# EAGLE design linvinus_ups (EAGLE 7.3.0)
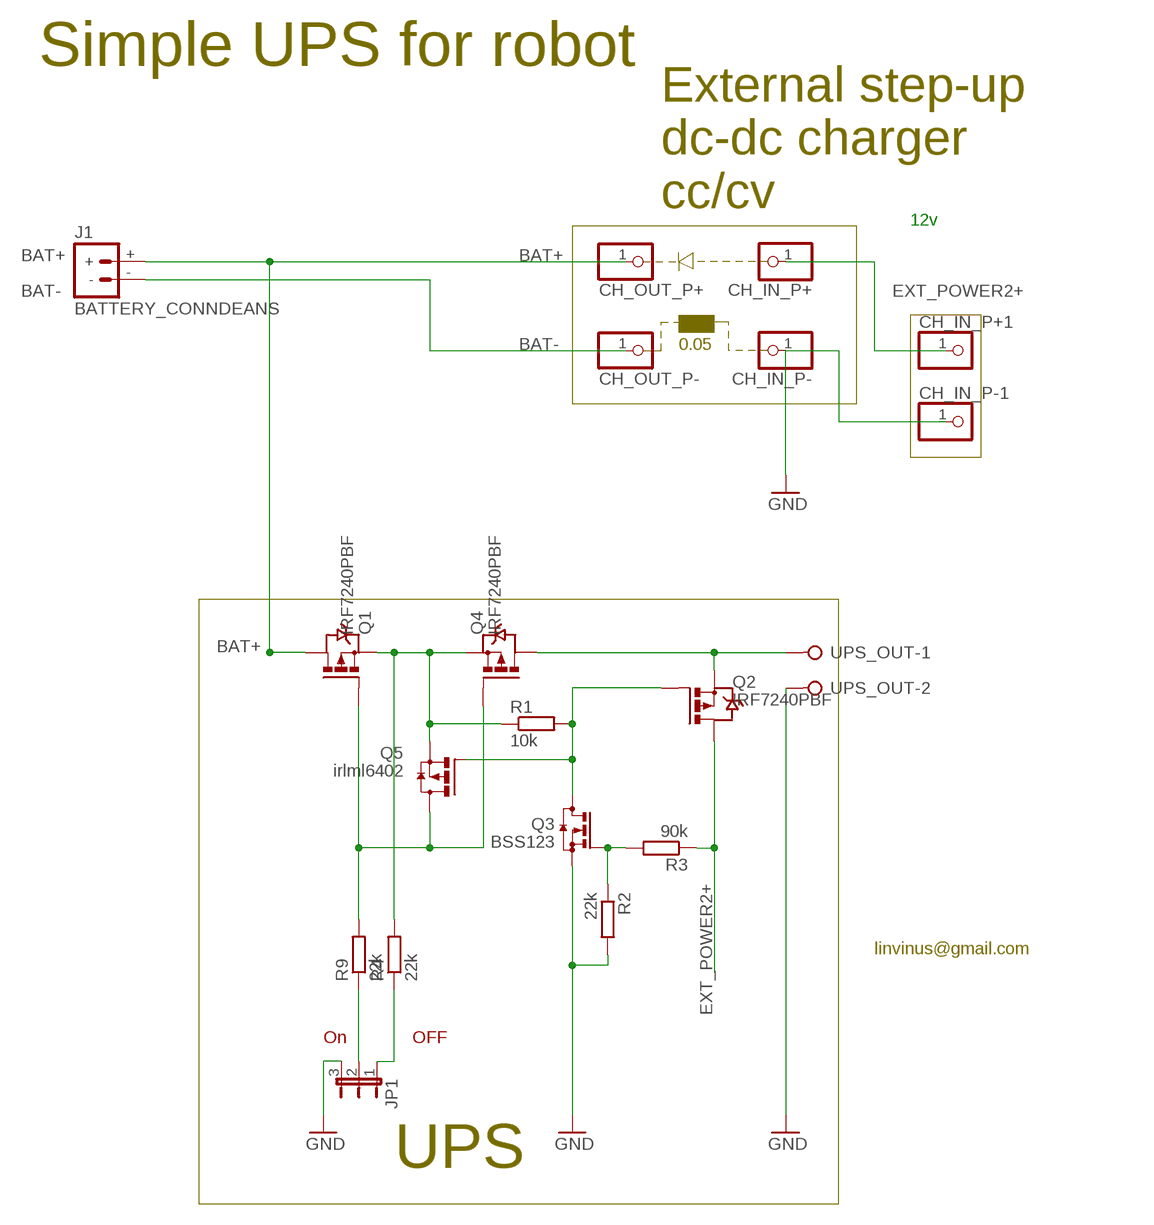
[diagram p0: schematic, sheet 1]

## Parts
CH_IN_P+  PINHD-1X1  [1X01]
CH_IN_P+1  PINHD-1X1  [1X01]
CH_IN_P-  PINHD-1X1  [1X01]
CH_IN_P-1  PINHD-1X1  [1X01]
CH_OUT_P+  PINHD-1X1  [1X01]
CH_OUT_P-  PINHD-1X1  [1X01]
J1  BATTERY_CONNDEANS  [DEANS]
JP1  JP2E  [JP2]
Q1  IRF7240PBF  P-MOSFET-SO8  [SO-08]
Q2  IRF7240PBF  P-MOSFET-SO8  [SO-08]
Q3  BSS123  [SOT23]
Q4  IRF7240PBF  P-MOSFET-SO8  [SO-08]
Q5  irlml6402  FDN360P  [SUPER-SOT3]
R1  10k  R-EU_R0805  [R0805]
R2  22k  R-EU_R0805  [R0805]
R3  90k  R-EU_R0805  [R0805]
R4  22k  R-EU_R0805  [R0805]
R9  22k  R-EU_R0805  [R0805]
UPS_OUT  W237-02P  [W237-132]

## Nets
BAT+: CH_OUT_P+.1 J1.+ Q1.5(D) Q1.6(D) Q1.7(D) Q1.8(D)
BAT-: CH_OUT_P-.1 J1.-
EXT_POWER2+: CH_IN_P+1.1 CH_IN_P+.1 Q2.5(D) Q2.6(D) Q2.7(D) Q2.8(D) R3.1
GND: CH_IN_P-1.1 CH_IN_P-.1 JP1.3 Q3.2(S) R2.2 UPS_OUT.2
N$1: Q2.4(G) Q3.3(D) Q5.1(G) R1.2
N$2: Q3.1(G) R2.1 R3.2
N$4: JP1.2 R9.1
N$5: Q1.1(S) Q1.2(S) Q1.3(S) Q4.1(S) Q4.2(S) Q4.3(S) Q5.2(S) R1.1 R4.2
N$6: Q2.1(S) Q2.2(S) Q2.3(S) Q4.5(D) Q4.6(D) Q4.7(D) Q4.8(D) UPS_OUT.1
N$7: JP1.1 R4.1
N$10: Q1.4(G) Q4.4(G) Q5.3(D) R9.2

## Notes on the sheet
- Simple UPS for robot
- External step-up 
  dc-dc charger
  cc/cv
- 12v
- 0.05
- linvinus@gmail.com
- On | OFF
- UPS

## Library data of the parts
CH_IN_P+ CH_IN_P+1 CH_IN_P- CH_IN_P-1 CH_OUT_P+ CH_OUT_P- = pinhead:PINHD-1X1: PIN HEADER
J1 = SparkFun-Connectors:BATTERY_CONN: Various footprints for battery connectors
JP1 = jumper:JP2E: JUMPER
Q1 Q2 Q4 = transistor-power:P-MOSFET-SO8: P-Channel MOSFET Example: FDS4435A; P-Channel Logic Level PowerTrench® MOSFET FDS4465; P-Channel 1.8V Specified PowerTrench® MOSFET Source: www.fairchildsemi.com
Q3 = transistor-small-signal:BSS123: N-CHANNEL MOS FET
Q5 = transistor-power:FDN360P: Single P-Channel, PowerTrench (R) MOSFET Source: http://www.fairchildsemi.com/ds/FD/FDN360P.pdf
R1-R4 R9 = resistor:R-EU_: RESISTOR, European symbol
UPS_OUT = con-wago-508:W237-02P: WAGO SREW CLAMP; OC_FARNELL: unknown; OC_NEWARK: unknown

## Board
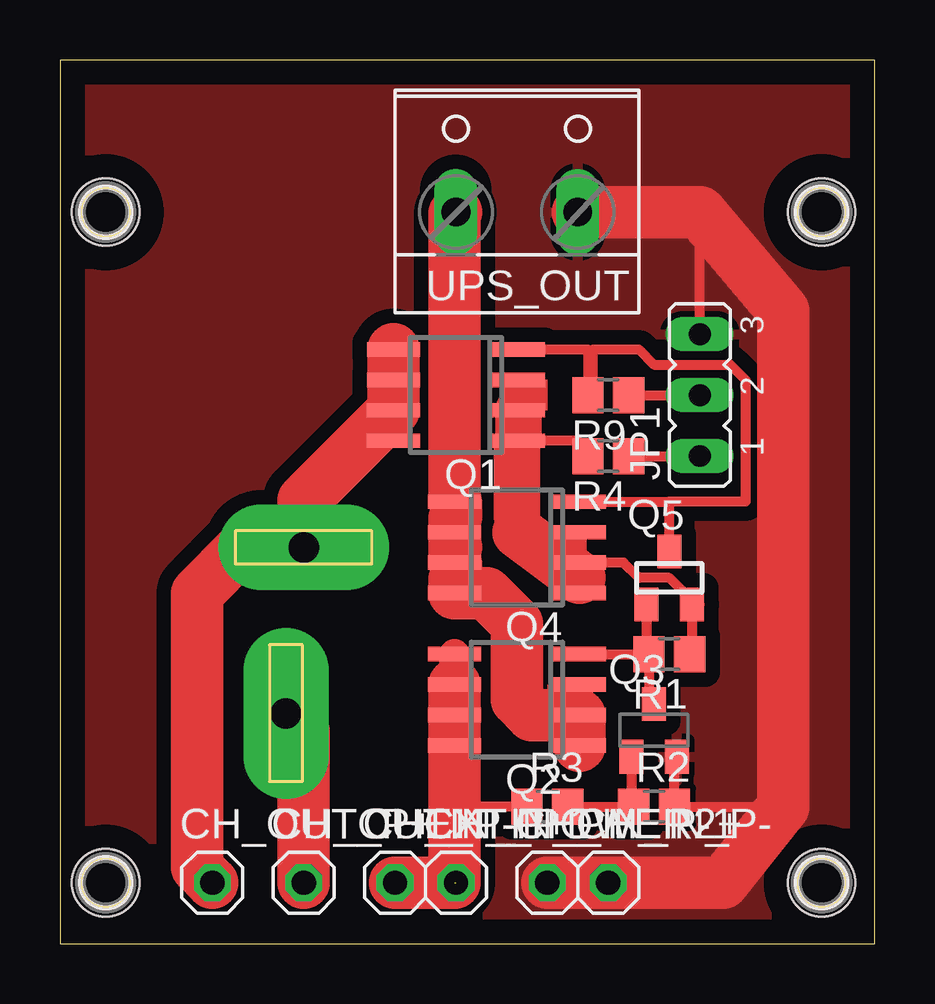
[diagram p1: board, top side]
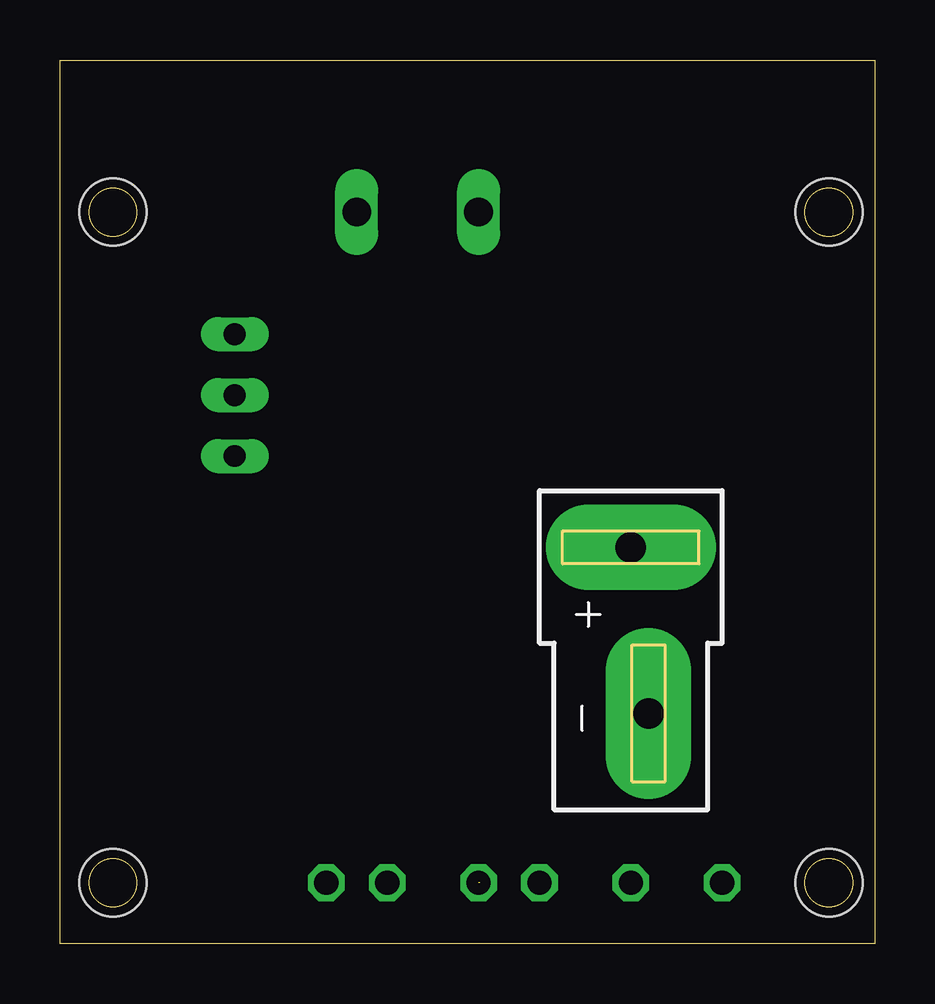
[diagram p2: board, bottom side, seen from below]

Size 33.96 x 36.82 mm. Coordinates in mm from the lower left corner, seen from the top.
Outline: 0,0 33.96,0 33.96,36.82 0,36.82 0,0
Copper layers (1*16): Top 0.035mm / dielectric 1.5mm / Bottom 0.035mm
Design rules "default": minimum track width 10mil, minimum drill 24mil, track to track 8mil, track to pad 8mil, pad to pad 8mil, via to via 8mil, smd to smd 8mil, copper to edge 40mil, drill to drill 8mil, minimum pad ring 10mil, minimum via ring 8mil, stop-mask expansion 4mil, vias tented up to drill 0mil, thermal gap 10mil

### Footprints (pad centres in the part's own frame; a part is rotated, then mirrored left to right if it is on the bottom)
1X01 = drill 1.016 octagon: 1 0,0
DEANS = drill 1.27 pad 3.556 long: + 0,0; - 0.737,-6.921
JP2 = drill 0.914 long: 1 -2.54,0; 2 0,0; 3 2.54,0
SO-08 = smd 0.6 x 2.2: 1 -1.905,-2.6; 2 -0.635,-2.6; 3 0.635,-2.6; 4 1.905,-2.6; 5 1.905,2.6; 6 0.635,2.6; 7 -0.635,2.6; 8 -1.905,2.6
SOT23 = smd 1 x 1.4: 1 -0.95,-1.1; 2 0.95,-1.1; 3 0,1.1
SUPER-SOT3 = smd 1 x 1.4: 1 -0.95,-1.1; 2 0.95,-1.1; 3 0,1.1
R0805 = smd 1.3 x 1.5: 1 -0.85,0; 2 0.85,0
2 = hole 2.8: 0,0
W237-132 = drill 1.194 long: 1 -2.54,-0.635; 2 2.54,-0.635

### Placement (x,y rotation side)
CH_IN_P+  16.51,2.54 0 top
CH_IN_P+1  13.97,2.54 0 top
CH_IN_P-  22.86,2.54 0 top
CH_IN_P-1  20.32,2.54 0 top
CH_OUT_P+  6.35,2.54 0 top
CH_OUT_P-  10.16,2.54 0 top
EXT_POWER2+  [1X01]  16.51,2.54 0 top
J1  10.16,16.51 0 bottom
JP1  26.67,22.86 90 top
Q1  16.51,22.86 90 top
Q2  19.05,10.16 90 top
Q3  24.77,8.89 0 top
Q4  19.05,16.51 90 top
Q5  25.4,15.24 0 top
R1  25.4,12.06 180 top
R2  24.77,5.71 0 top
R3  20.32,5.71 0 top
R4  22.86,20.32 180 top
R9  22.86,22.86 180 top
U$1  [2]  31.75,30.48 0 top
U$2  [2]  1.91,30.48 0 top
U$3  [2]  31.75,2.54 0 top
U$4  [2]  1.91,2.54 0 top
UPS_OUT  19.05,31.11 0 top

### Tracks (layer width: path | path; a pad name or v marks a point on that pad's centre or on a via)
BAT+
  Top 0.406: Q1.7 Q1.8
  Top 2.184: Q1.5 Q1.6 Q1.7 10.16,18.48 J1.+ 7.62,16.51 5.71,14.6 5.71,3.17 CH_OUT_P+.1
BAT-
  Top 2.184: CH_OUT_P-.1 10.16,8.85 J1.-
EXT_POWER2+  (1 unrouted)
  Top 0.406: R3.1 17.09,5.71 16.45,6.35
  Top 1.27: Q2.5 Q2.6
  Top 2.184: Q2.6 Q2.7 Q2.8 16.45,6.35 16.45,2.54 CH_IN_P+1.1
GND
  Top 0.406: 30.16,5.71 R2.2 25.62,7.69 Q3.2 | JP1.3 26.67,30.48
  Top 2.184: UPS_OUT.2 26.67,30.48 30.16,26.35 30.16,5.71 27.62,2.54 CH_IN_P-.1 CH_IN_P-1.1
  pour Top (isolate 0.61): -1.27,-1.27 35.56,-1.27 35.56,39.37 -1.27,39.37
N$1
  Top 0.406: Q5.1 24.45,12.17 R1.2 | Q2.4 R1.2 | R1.2 24.55,10.21 Q3.3
N$2
  Top 0.406: R3.2 R2.1 23.81,5.81 Q3.1
N$4
  Top 0.406: R9.1 JP1.2
N$5
  Top 0.406: Q4.1 21.65,15.24 Q4.2 23.49,15.87 24.13,15.24 25.4,15.24 26.5,14.14 | 19.05,20.95 Q1.1 21.59,20.95 22.01,20.53 R4.2 | 19.05,17.78 19.11,17.14 | 26.5,14.14 Q5.2 26.35,12.17 R1.1 | 26.67,14.14 26.5,14.14
  Top 0.61: Q1.2 Q1.3 | Q4.3 Q4.2
  Top 1.93: Q1.1 Q1.2 | 19.05,20.95 19.05,17.78
  Top 2.184: 19.11,17.14 21.65,15.24
N$6
  Top 0.406: 22.07,9.31 21.65,8.89 | Q2.2 Q2.3
  Top 2.184: Q2.1 21.65,8.89 Q2.2 19.69,9.53 19.05,10.16 19.05,13.33 17.78,14.6 Q4.8 16.45,15.18 16.51,15.24 16.51,15.81 Q4.7 16.45,16.45 16.51,16.51 16.45,16.57 Q4.6 16.45,17.72 16.51,17.78 16.51,18.35 Q4.5 16.45,30.42 UPS_OUT.1
N$7
  Top 0.406: R4.1 JP1.1
N$10
  Top 0.406: Q4.4 25.4,18.41 | Q1.4 22.01,24.77 R9.2 22.23,23.49 22.23,24.77 24.13,24.77 24.77,24.13 27.94,24.13 28.57,23.49 28.57,18.41 25.4,18.41 | Q5.3 25.4,18.41
(copper drawn outside any net)
  shapes: Top area x2